# EAGLE design full_design (EAGLE 9.7.0)
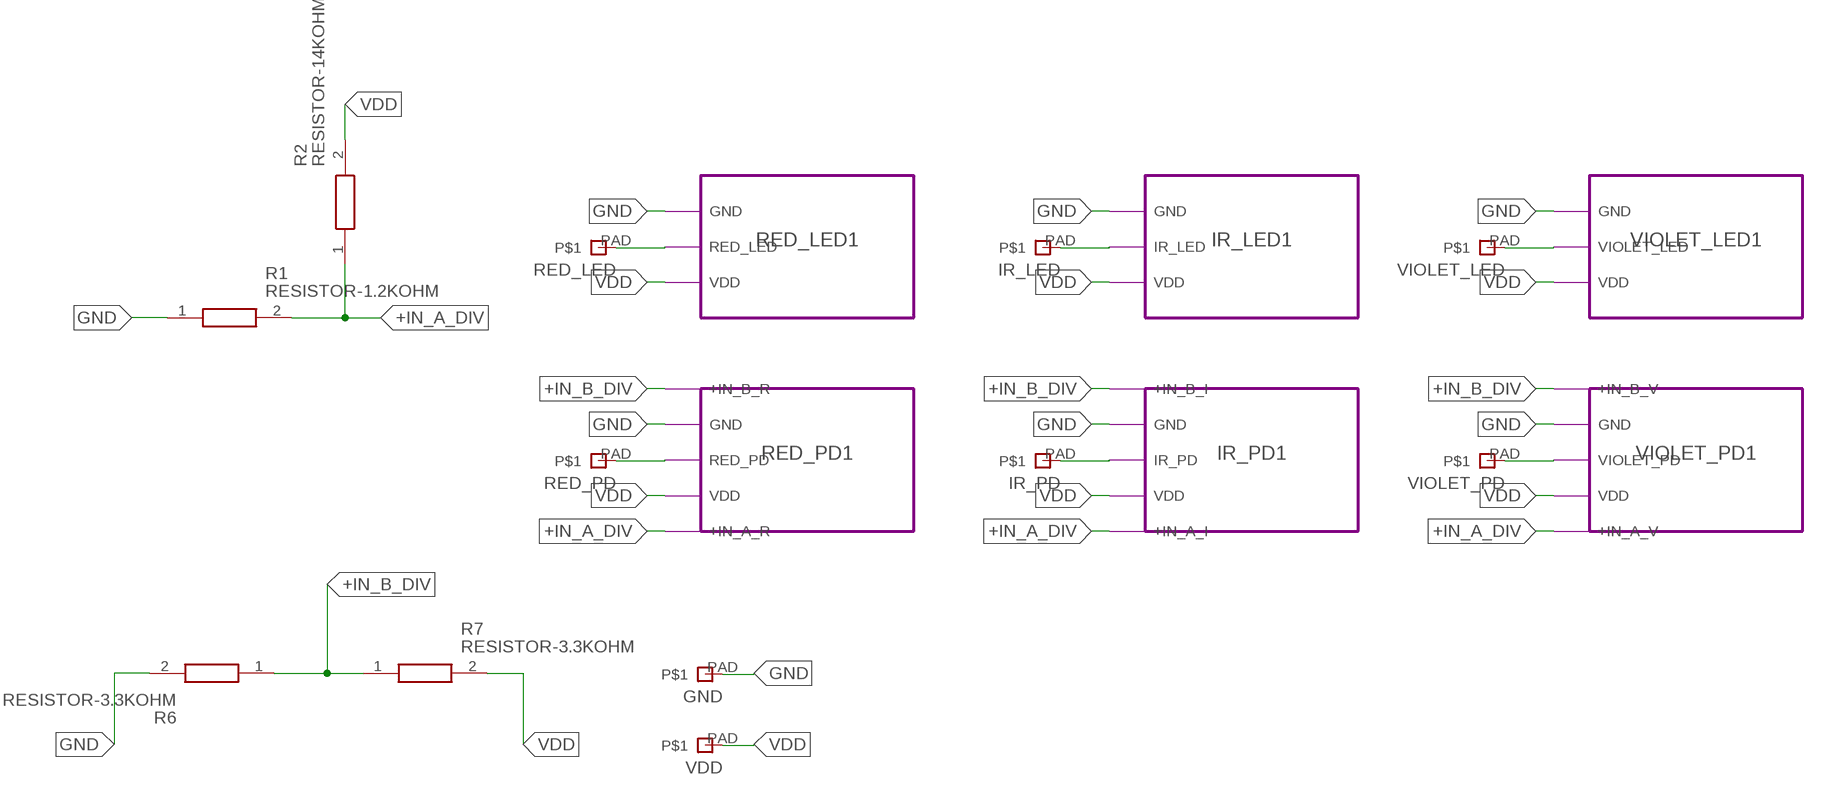
[diagram p0: schematic, sheet 1]

## Parts
GND  PAD  [PAD]
IR_LED  PAD  [PAD]
IR_PD  PAD  [PAD]
R1  RESISTOR-1.2KOHM  [ERJPA2_(0402)]
R2  RESISTOR-14KOHM  [ERJ2RKD1004X]
R6  RESISTOR-3.3KOHM  [ERJPA2_(0402)]
R7  RESISTOR-3.3KOHM  [ERJPA2_(0402)]
RED_LED  PAD  [PAD]
RED_PD  PAD  [PAD]
VDD  PAD  [PAD]
VIOLET_LED  PAD  [PAD]
VIOLET_PD  PAD  [PAD]

## Module instances
RED_LED1 = RED_LED
IR_LED1 = IR_LED
VIOLET_LED1 = VIOLET_LED
RED_PD1 = RED_PD
IR_PD1 = IR_PD
VIOLET_PD1 = VIOLET_PD

## Nets
+IN_A_DIV: R1.2 R2.1 ; port RED_PD1.+IN_A_R IR_PD1.+IN_A_I VIOLET_PD1.+IN_A_V
+IN_B_DIV: R6.1 R7.1 ; port RED_PD1.+IN_B_R IR_PD1.+IN_B_I VIOLET_PD1.+IN_B_V
GND: GND.PAD R1.1 R6.2 ; port RED_LED1.GND RED_PD1.GND IR_LED1.GND VIOLET_LED1.GND IR_PD1.GND VIOLET_PD1.GND
N$1: RED_PD.PAD ; port RED_PD1.RED_PD
N$2: RED_LED.PAD ; port RED_LED1.RED_LED
N$3: IR_LED.PAD ; port IR_LED1.IR_LED
N$4: VIOLET_LED.PAD ; port VIOLET_LED1.VIOLET_LED
N$5: VIOLET_PD.PAD ; port VIOLET_PD1.VIOLET_PD
N$6: IR_PD.PAD ; port IR_PD1.IR_PD
VDD: R2.2 R7.2 VDD.PAD ; port RED_LED1.VDD IR_LED1.VDD VIOLET_LED1.VDD RED_PD1.VDD IR_PD1.VDD VIOLET_PD1.VDD

## Library data of the parts
GND IR_LED IR_PD RED_LED RED_PD VDD VIOLET_LED VIOLET_PD = Nordic_BLE:PAD
R1 = MABOS_Library:RESISTOR-1.2KOHM: Anti-Surge Thick Film Chip Resistor, 0402, 0.2W Source: Datasheet <https://componentsearchengine.com/Datasheets/1/ERJ-PA2D1201X.pdf>; DESCRIPTION: Anti-Surge Thick Film Chip Resistor, 0402, 0.2W; HEIGHT: 0.4mm; MANUFACTURER_NAME: Panasonic; MANUFACTURER_PART_NUMBER: ERJ-PA2D1201X; MOUSER_PART_NUMBER: 667-ERJ-PA2D1201X; MOUSER_PRICE-STOCK: https://www.mouser.com/Search/Refine.aspx?Keyword=667-ERJ-PA2D1201X
R2 = MABOS_Library:RESISTOR-14KOHM: Panasonic ERJ2RK Series Thick Film Resistor 14k +/-1% 0.1W +/-100ppm/C Source: Datasheet <https://componentsearchengine.com/Datasheets/1/ERJ-2RKF1402X.pdf>; DESCRIPTION: Panasonic ERJ2RK Series Thick Film Resistor 14k +/-1% 0.1W +/-100ppm/C; HEIGHT: 0.4mm; MANUFACTURER_NAME: Panasonic; MANUFACTURER_PART_NUMBER: ERJ-2RKF1402X; MOUSER_PART_NUMBER: 667-ERJ-2RKF1402X; MOUSER_PRICE-STOCK: https://www.mouser.com/Search/ProductDetail.aspx?qs=MVjVSMjNRMrMgFTFLdW36A%3d%3d
R6 R7 = MABOS_Library:RESISTOR-3.3KOHM: Anti-Surge Thick Film Chip Resistor, 0402, 0.2W Source: Datasheet <https://componentsearchengine.com/Datasheets/1/ERJ-PA2F3301X.pdf>; DESCRIPTION: Anti-Surge Thick Film Chip Resistor, 0402, 0.2W; HEIGHT: 0.4mm; MANUFACTURER_NAME: Panasonic; MANUFACTURER_PART_NUMBER: ERJ-PA2F3301X; MOUSER_PART_NUMBER: 667-ERJ-PA2F3301X; MOUSER_PRICE-STOCK: https://www.mouser.com/Search/Refine.aspx?Keyword=667-ERJ-PA2F3301X

## Module RED_LED
Ports: GND(pwr) VDD(pwr) RED_LED(in)
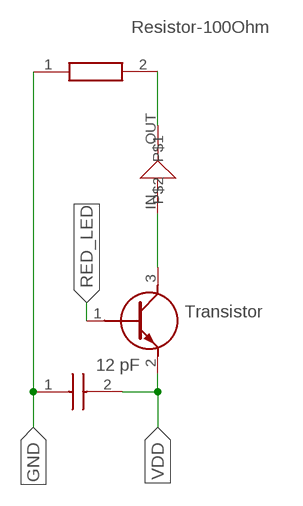
[diagram p1: schematic, module RED_LED, sheet 1]

### Parts
C3  CAPACITOR-12PF  [CAPC1005X55N]
Q1  TRANSISTOR  [SOT883B]
R5  RESISTOR-100OHM  [RESC1608X55N]
U$1  REDLED  [REDLED]

### Nets
GND: C3.1 R5.1
N$7: Q1.3(C) U$1.IN
N$13: R5.2 U$1.OUT
RED_LED: Q1.1(B)
VDD: C3.2 Q1.2(E)

### Library data of the parts
C3 = MABOS_Library:CAPACITOR-12PF: 12 pF; DESCRIPTION: Multilayer Ceramic Capacitors MLCC - SMD/SMT 12pF 2% 25V C0G; HEIGHT: 0.55mm; MANUFACTURER_NAME: Kemet; MANUFACTURER_PART_NUMBER: C0402C120G3GACTU; MOUSER_PART_NUMBER: 80-C0402C120G3G; MOUSER_PRICE-STOCK: https://www.mouser.com/Search/Refine.aspx?Keyword=80-C0402C120G3G
Q1 = MABOS_Library:TRANSISTOR: Bipolar Transistors - BJT 45V NPN 100mA 250mW Source: Datasheet <https://componentsearchengine.com/Datasheets/1/BC847BMB,315.pdf>; DESCRIPTION: Bipolar Transistors - BJT 45V NPN 100mA 250mW; HEIGHT: mm; MANUFACTURER_NAME: Nexperia; MANUFACTURER_PART_NUMBER: BC847BMB,315; MOUSER_PART_NUMBER: 771-BC847BMB315; MOUSER_PRICE-STOCK: https://www.mouser.co.uk/ProductDetail/Nexperia/BC847BMB315?qs=5C9Q4QJFsuN7bUmIcU4LYw%3D%3D
R5 = MABOS_Library:RESISTOR-100OHM: Thick Film Resistors - SMD 100 OHM .1% 50PPM Source: Datasheet; DESCRIPTION: Thick Film Resistors - SMD 100 OHM .1% 50PPM; HEIGHT: 0.55mm; MANUFACTURER_NAME: KOA Speer; MANUFACTURER_PART_NUMBER: RS73G1JTTD1000B; MOUSER_PART_NUMBER: 660-RS73G1JTTD1000B; MOUSER_PRICE-STOCK: https://www.mouser.co.uk/ProductDetail/KOA-Speer/RS73G1JTTD1000B/?qs=GBLSl2AkiruQBcK7exZ%252Bcg%3D%3D
U$1 = MABOS_Library:REDLED

## Module IR_LED
Ports: IR_LED(in) GND(pwr) VDD(pwr)
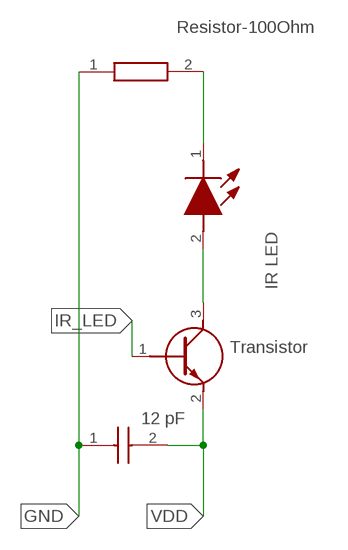
[diagram p2: schematic, module IR_LED, sheet 1]

### Parts
C1  CAPACITOR-12PF  [CAPC1005X55N]
LED1  IRLED  [LEDC3216X180N]
Q1  TRANSISTOR  [SOT883B]
R1  RESISTOR-100OHM  [RESC1608X55N]

### Nets
GND: C1.1 R1.1
IR_LED: Q1.1(B)
N$1: LED1.1(K) R1.2
N$4: LED1.2(A) Q1.3(C)
VDD: C1.2 Q1.2(E)

### Library data of the parts
C1 = MABOS_Library:CAPACITOR-12PF: 12 pF; DESCRIPTION: Multilayer Ceramic Capacitors MLCC - SMD/SMT 12pF 2% 25V C0G; HEIGHT: 0.55mm; MANUFACTURER_NAME: Kemet; MANUFACTURER_PART_NUMBER: C0402C120G3GACTU; MOUSER_PART_NUMBER: 80-C0402C120G3G; MOUSER_PRICE-STOCK: https://www.mouser.com/Search/Refine.aspx?Keyword=80-C0402C120G3G
LED1 = MABOS_Library:IRLED: Infrared Emitters 3.2x1.6mm IR SMD LED Source: Datasheet <https://www.arrow.com/en/products/aptd3216f3c-p22/kingbright>; DESCRIPTION: Infrared Emitters 3.2x1.6mm IR SMD LED; HEIGHT: 1.8mm; MANUFACTURER_NAME: Kingbright; MANUFACTURER_PART_NUMBER: APTD3216F3C-P22; MOUSER_PART_NUMBER: 604-APTD3216F3C-P22; MOUSER_PRICE-STOCK: https://www.mouser.co.uk/ProductDetail/Kingbright/APTD3216F3C-P22?qs=fAHHVMwC%252Bbjo55EMkwMBzg%3D%3D
Q1 = MABOS_Library:TRANSISTOR: Bipolar Transistors - BJT 45V NPN 100mA 250mW Source: Datasheet <https://componentsearchengine.com/Datasheets/1/BC847BMB,315.pdf>; DESCRIPTION: Bipolar Transistors - BJT 45V NPN 100mA 250mW; HEIGHT: mm; MANUFACTURER_NAME: Nexperia; MANUFACTURER_PART_NUMBER: BC847BMB,315; MOUSER_PART_NUMBER: 771-BC847BMB315; MOUSER_PRICE-STOCK: https://www.mouser.co.uk/ProductDetail/Nexperia/BC847BMB315?qs=5C9Q4QJFsuN7bUmIcU4LYw%3D%3D
R1 = MABOS_Library:RESISTOR-100OHM: Thick Film Resistors - SMD 100 OHM .1% 50PPM Source: Datasheet; DESCRIPTION: Thick Film Resistors - SMD 100 OHM .1% 50PPM; HEIGHT: 0.55mm; MANUFACTURER_NAME: KOA Speer; MANUFACTURER_PART_NUMBER: RS73G1JTTD1000B; MOUSER_PART_NUMBER: 660-RS73G1JTTD1000B; MOUSER_PRICE-STOCK: https://www.mouser.co.uk/ProductDetail/KOA-Speer/RS73G1JTTD1000B/?qs=GBLSl2AkiruQBcK7exZ%252Bcg%3D%3D

## Module VIOLET_LED
Ports: GND(pwr) VDD(pwr) VIOLET_LED(in)
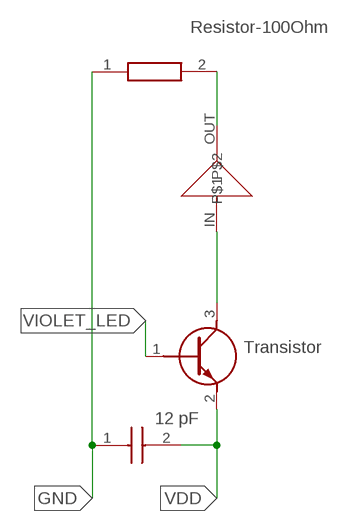
[diagram p3: schematic, module VIOLET_LED, sheet 1]

### Parts
C1  CAPACITOR-12PF  [CAPC1005X55N]
Q1  TRANSISTOR  [SOT883B]
R1  RESISTOR-100OHM  [RESC1608X55N]
U$1  UVLED  [UVLED]

### Nets
GND: C1.1 R1.1
N$1: R1.2 U$1.OUT
N$2: Q1.3(C) U$1.IN
VDD: C1.2 Q1.2(E)
VIOLET_LED: Q1.1(B)

### Library data of the parts
C1 = MABOS_Library:CAPACITOR-12PF: 12 pF; DESCRIPTION: Multilayer Ceramic Capacitors MLCC - SMD/SMT 12pF 2% 25V C0G; HEIGHT: 0.55mm; MANUFACTURER_NAME: Kemet; MANUFACTURER_PART_NUMBER: C0402C120G3GACTU; MOUSER_PART_NUMBER: 80-C0402C120G3G; MOUSER_PRICE-STOCK: https://www.mouser.com/Search/Refine.aspx?Keyword=80-C0402C120G3G
Q1 = MABOS_Library:TRANSISTOR: Bipolar Transistors - BJT 45V NPN 100mA 250mW Source: Datasheet <https://componentsearchengine.com/Datasheets/1/BC847BMB,315.pdf>; DESCRIPTION: Bipolar Transistors - BJT 45V NPN 100mA 250mW; HEIGHT: mm; MANUFACTURER_NAME: Nexperia; MANUFACTURER_PART_NUMBER: BC847BMB,315; MOUSER_PART_NUMBER: 771-BC847BMB315; MOUSER_PRICE-STOCK: https://www.mouser.co.uk/ProductDetail/Nexperia/BC847BMB315?qs=5C9Q4QJFsuN7bUmIcU4LYw%3D%3D
R1 = MABOS_Library:RESISTOR-100OHM: Thick Film Resistors - SMD 100 OHM .1% 50PPM Source: Datasheet; DESCRIPTION: Thick Film Resistors - SMD 100 OHM .1% 50PPM; HEIGHT: 0.55mm; MANUFACTURER_NAME: KOA Speer; MANUFACTURER_PART_NUMBER: RS73G1JTTD1000B; MOUSER_PART_NUMBER: 660-RS73G1JTTD1000B; MOUSER_PRICE-STOCK: https://www.mouser.co.uk/ProductDetail/KOA-Speer/RS73G1JTTD1000B/?qs=GBLSl2AkiruQBcK7exZ%252Bcg%3D%3D
U$1 = MABOS_Library:UVLED

## Module RED_PD
Ports: GND(pwr) VDD(pwr) RED_PD(pwr) +IN_A_R(pwr) +IN_B_R(pwr)
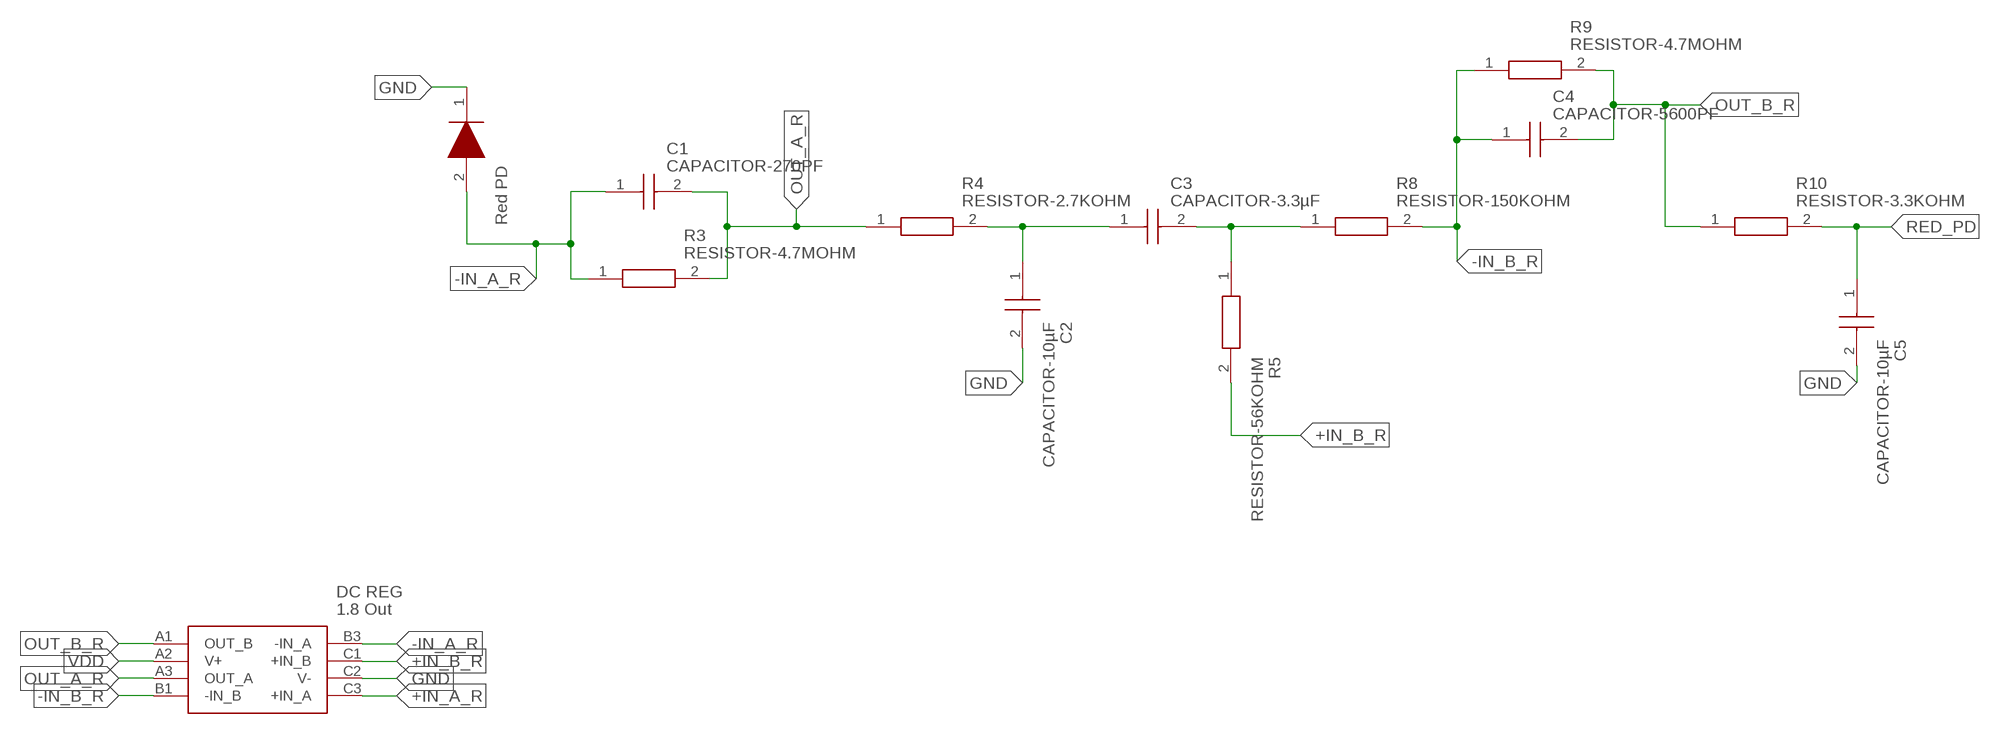
[diagram p4: schematic, module RED_PD, sheet 1]

### Parts
C1  CAPACITOR-270PF  [CAPC1005X55N]
C2  CAPACITOR-10µF  [C0402]
C3  CAPACITOR-3.3µF  [C0402]
C4  CAPACITOR-5600PF  [CAPC1005X55N]
C5  CAPACITOR-10µF  [C0402]
D1  REDPD  [SFH2713]
IC1  ADA4505-2  [BGA8C50P3X3_142X142X65]
R3  RESISTOR-4.7MOHM  [ERJ2RKD1004X]
R4  RESISTOR-2.7KOHM  [ERJPA2_(0402)]
R5  RESISTOR-56KOHM  [ERJ2RKD1004X]
R8  RESISTOR-150KOHM  [ERJS02_U02_(0402)]
R9  RESISTOR-4.7MOHM  [ERJ2RKD1004X]
R10  RESISTOR-3.3KOHM  [ERJPA2_(0402)]

### Nets
+IN_A_R: IC1.C3(+IN_A)
+IN_B_R: IC1.C1(+IN_B) R5.2
-IN_A_R: C1.1 D1.2(A) IC1.B3(-IN_A) R3.1
-IN_B_R: C4.1 IC1.B1(-IN_B) R8.2 R9.1
GND: C2.2 C5.2 D1.1(K) IC1.C2(V-)
N$1: C2.1 C3.1 R4.2
N$3: C3.2 R5.1 R8.1
OUT_A_R: C1.2 IC1.A3(OUT_A) R3.2 R4.1
OUT_B_R: C4.2 IC1.A1(OUT_B) R9.2 R10.1
RED_PD: C5.1 R10.2
VDD: IC1.A2(V+)

### Library data of the parts
C1 = MABOS_Library:CAPACITOR-270PF: SMD Comm C0G, Ceramic, 270 pF, 2%, 50 VDC, 125 VDC, 125C, -55C, C0G, SMD, MLCC, Ultra-Stable, Low Loss, Class I, 0.1 % , 100 GOhms, 1.06 mg, 0402, 1mm, 0.5mm, 0.5mm, 0.3mm, 0.3mm, 10000, 78 Weeks, 120 Source: Datasheet <https://componentsearchengine.com/Datasheets/1/C0402C271G5GACTU.pdf>; DESCRIPTION: SMD Comm C0G, Ceramic, 270 pF, 2%, 50 VDC, 125 VDC, 125C, -55C, C0G, SMD, MLCC, Ultra-Stable, Low Loss, Class I, 0.1 % , 100 GOhms, 1.06 mg, 0402, 1mm, 0.5mm, 0.5mm, 0.3mm, 0.3mm, 10000, 78 Weeks, 120; HEIGHT: 0.55mm; MANUFACTURER_NAME: KEMET; MANUFACTURER_PART_NUMBER: C0402C271G5GACTU; MOUSER_PART_NUMBER: 80-C0402C271G5G; MOUSER_PRICE-STOCK: https://www.mouser.com/Search/Refine.aspx?Keyword=80-C0402C271G5G
C2 C5 = MABOS_Library:CAPACITOR-10µF: SMD Comm X5R, Ceramic, 10 uF, 20%, 6.3 VDC, 15.75 VDC, 85C, -55C, X5R, SMD, MLCC, Temperature Stable, Class II, 10 % , 10 MOhms, 1.41 mg, 0402, 1mm, 0.5mm, 0.5mm, 0.3mm, 0.3mm, 10000, 78 Weeks, 70 Source: Datasheet <https://content.kemet.com/datasheets/KEM_C1006_X5R_SMD.pdf>; DESCRIPTION: SMD Comm X5R, Ceramic, 10 uF, 20%, 6.3 VDC, 15.75 VDC, 85C, -55C, X5R, SMD, MLCC, Temperature Stable, Class II, 10 % , 10 MOhms, 1.41 mg, 0402, 1mm, 0.5mm, 0.5mm, 0.3mm, 0.3mm, 10000, 78 Weeks, 70; HEIGHT: 0.55mm; MANUFACTURER_NAME: KEMET; MANUFACTURER_PART_NUMBER: C0402C106M9PACTU; MOUSER_PART_NUMBER: 80-C0402C106M9P; MOUSER_PRICE-STOCK: https://www.mouser.co.uk/ProductDetail/KEMET/C0402C106M9PACTU?qs=x4XeXhDQKnp%252Bz0lMlwMC3A%3D%3D
C3 = MABOS_Library:CAPACITOR-3.3µF: SMD Comm X5R, Ceramic, 3.3 uF, 20%, 4 VDC, 10 VDC, 85C, -55C, X5R, SMD, MLCC, Temperature Stable, Class II, 10 % , 30.3 MOhms, 1.21 mg, 0402, 1mm, 0.5mm, 0.5mm, 0.3mm, 0.3mm, 10000, 78 Weeks, 70 Source: Datasheet <https://content.kemet.com/datasheets/KEM_C1006_X5R_SMD.pdf>; DESCRIPTION: SMD Comm X5R, Ceramic, 3.3 uF, 20%, 4 VDC, 10 VDC, 85C, -55C, X5R, SMD, MLCC, Temperature Stable, Class II, 10 % , 30.3 MOhms, 1.21 mg, 0402, 1mm, 0.5mm, 0.5mm, 0.3mm, 0.3mm, 10000, 78 Weeks, 70; HEIGHT: 0.55mm; MANUFACTURER_NAME: KEMET; MANUFACTURER_PART_NUMBER: C0402C335M7PACTU; MOUSER_PART_NUMBER: 80-C0402C335M7P; MOUSER_PRICE-STOCK: https://www.mouser.co.uk/ProductDetail/KEMET/C0402C335M7PACTU?qs=K%2Fj%2Fqf%252B0fqJuKSSbbJXSEQ%3D%3D
C4 = MABOS_Library:CAPACITOR-5600PF: SMD Comm X7R, Ceramic, 5600 pF, 5%, 16 VDC, 40 VDC, 125C, -55C, X7R, SMD, MLCC, Temperature Stable, Class II, 3.5 % , 100 GOhms, 1.21 mg, 0402, 1mm, 0.5mm, 0.5mm, 0.3mm, 0.3mm, 10000, 78 Weeks, 80 Source: Datasheet <https://content.kemet.com/datasheets/KEM_C1002_X7R_SMD.pdf>; DESCRIPTION: SMD Comm X7R, Ceramic, 5600 pF, 5%, 16 VDC, 40 VDC, 125C, -55C, X7R, SMD, MLCC, Temperature Stable, Class II, 3.5 % , 100 GOhms, 1.21 mg, 0402, 1mm, 0.5mm, 0.5mm, 0.3mm, 0.3mm, 10000, 78 Weeks, 80; HEIGHT: 0.55mm; MANUFACTURER_NAME: KEMET; MANUFACTURER_PART_NUMBER: C0402C562J4RACTU; MOUSER_PART_NUMBER: 80-C0402C562J4R; MOUSER_PRICE-STOCK: https://www.mouser.co.uk/ProductDetail/KEMET/C0402C562J4RACTU?qs=YJD0VjdmSUns5e35Blws8w%3D%3D
D1 = MABOS_Library:REDPD: Photodiodes Silicon PIN Photodiode Source: Datasheet <https://dammedia.osram.info/media/resource/hires/osram-dam-8960377/SFH 2713_EN.pdf>; DESCRIPTION: Photodiodes Silicon PIN Photodiode; HEIGHT: 0.7mm; MANUFACTURER_NAME: OSRAM; MANUFACTURER_PART_NUMBER: SFH 2713; MOUSER_PART_NUMBER: 720-SFH2713; MOUSER_PRICE-STOCK: https://www.mouser.co.uk/ProductDetail/OSRAM-Opto-Semiconductors/SFH-2713?qs=7MVldsJ5UayBhtoy5c4X7w%3D%3D
IC1 = MABOS_Library:ADA4505-2: Op Amp (2); DESCRIPTION: ANALOG DEVICES - ADA4505-2ACBZ-R7 - OP-AMP, DUAL, 50KHZ, WLCSP-8; HEIGHT: 0.65mm; MANUFACTURER_NAME: Analog Devices; MANUFACTURER_PART_NUMBER: ADA4505-2ACBZ-R7; MOUSER_PART_NUMBER: 584-ADA4505-2ACBZ-R7; MOUSER_PRICE-STOCK: https://www.mouser.co.uk/ProductDetail/Analog-Devices/ADA4505-2ACBZ-R7?qs=BpaRKvA4VqEsLtXU3NSLDQ%3D%3D
R3 R9 = MABOS_Library:RESISTOR-4.7MOHM: Panasonic ERJ2GEJ Series Thick Film Surface Mount Fixed Resistor 0402 Case 4.7M +/-5% 0.1W -400 +150ppm/C Source: Datasheet <https://componentsearchengine.com/Datasheets/1/ERJ-2GEJ475X.pdf>; DESCRIPTION: Panasonic ERJ2GEJ Series Thick Film Surface Mount Fixed Resistor 0402 Case 4.7M +/-5% 0.1W -400 +150ppm/C; HEIGHT: 0.4mm; MANUFACTURER_NAME: Panasonic; MANUFACTURER_PART_NUMBER: ERJ-2GEJ475X; MOUSER_PART_NUMBER: 667-ERJ-2GEJ475X; MOUSER_PRICE-STOCK: https://www.mouser.com/Search/Refine.aspx?Keyword=667-ERJ-2GEJ475X
R4 = MABOS_Library:RESISTOR-2.7KOHM: Anti-Surge Thick Film Chip Resistor, 0402, 0.2W Source: Datasheet <http://industrial.panasonic.com/cdbs/www-data/pdf/RDO0000/AOA0000C331.pdf>; DESCRIPTION: Anti-Surge Thick Film Chip Resistor, 0402, 0.2W; HEIGHT: 0.4mm; MANUFACTURER_NAME: Panasonic; MANUFACTURER_PART_NUMBER: ERJ-PA2F2701X
R5 = MABOS_Library:RESISTOR-56KOHM: Precision Thick Film Chip Resistor, 0402, 0.063W Source: Datasheet <https://componentsearchengine.com/Datasheets/1/ERJ-2RKF5602X.pdf>; DESCRIPTION: Precision Thick Film Chip Resistor, 0402, 0.063W; HEIGHT: 0.4mm; MANUFACTURER_NAME: Panasonic; MANUFACTURER_PART_NUMBER: ERJ-2RKF5602X; MOUSER_PART_NUMBER: 667-ERJ-2RKF5602X; MOUSER_PRICE-STOCK: https://www.mouser.com/Search/Refine.aspx?Keyword=667-ERJ-2RKF5602X
R8 = MABOS_Library:RESISTOR-150KOHM: Anti-Sulfurated Thick Film Chip Resistor, 0402, 0.1W Source: Datasheet <https://componentsearchengine.com/Datasheets/1/ERJ-U02D1503X.pdf>; DESCRIPTION: Anti-Sulfurated Thick Film Chip Resistor, 0402, 0.1W; HEIGHT: 0.4mm; MANUFACTURER_NAME: Panasonic; MANUFACTURER_PART_NUMBER: ERJ-U02D1503X; MOUSER_PART_NUMBER: 667-ERJ-U02D1503X; MOUSER_PRICE-STOCK: https://www.mouser.com/Search/Refine.aspx?Keyword=667-ERJ-U02D1503X
R10 = MABOS_Library:RESISTOR-3.3KOHM: Anti-Surge Thick Film Chip Resistor, 0402, 0.2W Source: Datasheet <https://componentsearchengine.com/Datasheets/1/ERJ-PA2F3301X.pdf>; DESCRIPTION: Anti-Surge Thick Film Chip Resistor, 0402, 0.2W; HEIGHT: 0.4mm; MANUFACTURER_NAME: Panasonic; MANUFACTURER_PART_NUMBER: ERJ-PA2F3301X; MOUSER_PART_NUMBER: 667-ERJ-PA2F3301X; MOUSER_PRICE-STOCK: https://www.mouser.com/Search/Refine.aspx?Keyword=667-ERJ-PA2F3301X

## Module IR_PD
Ports: +IN_B_I(pwr) +IN_A_I(pwr) GND(pwr) VDD(pwr) IR_PD(out)
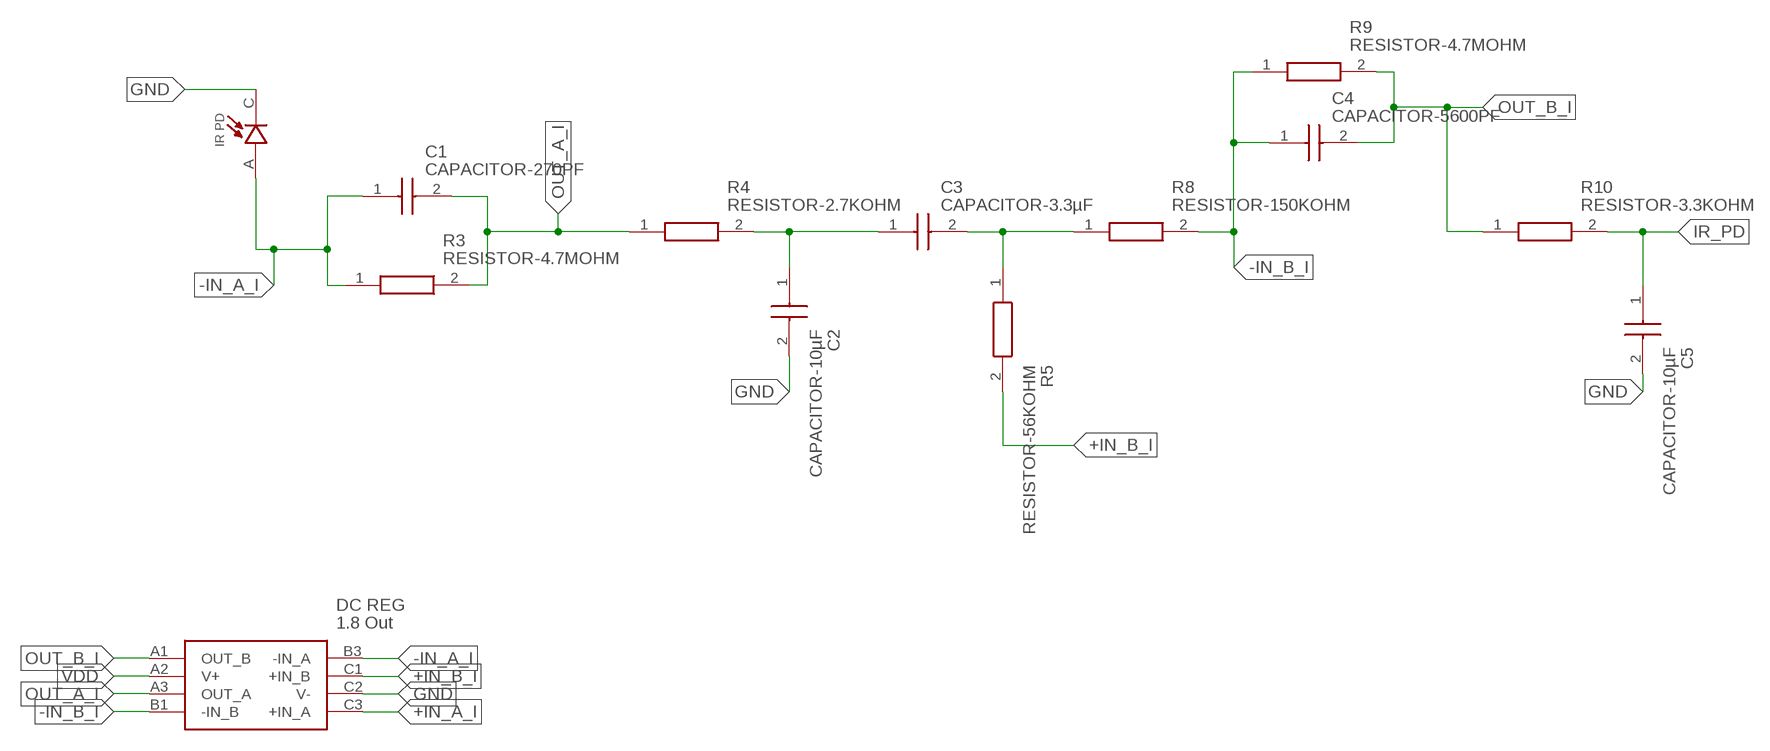
[diagram p5: schematic, module IR_PD, sheet 1]

### Parts
C1  CAPACITOR-270PF  [CAPC1005X55N]
C2  CAPACITOR-10µF  [C0402]
C3  CAPACITOR-3.3µF  [C0402]
C4  CAPACITOR-5600PF  [CAPC1005X55N]
C5  CAPACITOR-10µF  [C0402]
D1  IRPD  [XDCR_VEMD2023X01]
IC1  ADA4505-2  [BGA8C50P3X3_142X142X65]
R3  RESISTOR-4.7MOHM  [ERJ2RKD1004X]
R4  RESISTOR-2.7KOHM  [ERJPA2_(0402)]
R5  RESISTOR-56KOHM  [ERJ2RKD1004X]
R8  RESISTOR-150KOHM  [ERJS02_U02_(0402)]
R9  RESISTOR-4.7MOHM  [ERJ2RKD1004X]
R10  RESISTOR-3.3KOHM  [ERJPA2_(0402)]

### Nets
+IN_A_I: IC1.C3(+IN_A)
+IN_B_I: IC1.C1(+IN_B) R5.2
-IN_A_I: C1.1 D1.A IC1.B3(-IN_A) R3.1
-IN_B_I: C4.1 IC1.B1(-IN_B) R8.2 R9.1
GND: C2.2 C5.2 D1.C IC1.C2(V-)
IR_PD: C5.1 R10.2
N$5: C2.1 C3.1 R4.2
N$7: C3.2 R5.1 R8.1
OUT_A_I: C1.2 IC1.A3(OUT_A) R3.2 R4.1
OUT_B_I: C4.2 IC1.A1(OUT_B) R9.2 R10.1
VDD: IC1.A2(V+)

### Library data of the parts
C1 = MABOS_Library:CAPACITOR-270PF: SMD Comm C0G, Ceramic, 270 pF, 2%, 50 VDC, 125 VDC, 125C, -55C, C0G, SMD, MLCC, Ultra-Stable, Low Loss, Class I, 0.1 % , 100 GOhms, 1.06 mg, 0402, 1mm, 0.5mm, 0.5mm, 0.3mm, 0.3mm, 10000, 78 Weeks, 120 Source: Datasheet <https://componentsearchengine.com/Datasheets/1/C0402C271G5GACTU.pdf>; DESCRIPTION: SMD Comm C0G, Ceramic, 270 pF, 2%, 50 VDC, 125 VDC, 125C, -55C, C0G, SMD, MLCC, Ultra-Stable, Low Loss, Class I, 0.1 % , 100 GOhms, 1.06 mg, 0402, 1mm, 0.5mm, 0.5mm, 0.3mm, 0.3mm, 10000, 78 Weeks, 120; HEIGHT: 0.55mm; MANUFACTURER_NAME: KEMET; MANUFACTURER_PART_NUMBER: C0402C271G5GACTU; MOUSER_PART_NUMBER: 80-C0402C271G5G; MOUSER_PRICE-STOCK: https://www.mouser.com/Search/Refine.aspx?Keyword=80-C0402C271G5G
C2 C5 = MABOS_Library:CAPACITOR-10µF: SMD Comm X5R, Ceramic, 10 uF, 20%, 6.3 VDC, 15.75 VDC, 85C, -55C, X5R, SMD, MLCC, Temperature Stable, Class II, 10 % , 10 MOhms, 1.41 mg, 0402, 1mm, 0.5mm, 0.5mm, 0.3mm, 0.3mm, 10000, 78 Weeks, 70 Source: Datasheet <https://content.kemet.com/datasheets/KEM_C1006_X5R_SMD.pdf>; DESCRIPTION: SMD Comm X5R, Ceramic, 10 uF, 20%, 6.3 VDC, 15.75 VDC, 85C, -55C, X5R, SMD, MLCC, Temperature Stable, Class II, 10 % , 10 MOhms, 1.41 mg, 0402, 1mm, 0.5mm, 0.5mm, 0.3mm, 0.3mm, 10000, 78 Weeks, 70; HEIGHT: 0.55mm; MANUFACTURER_NAME: KEMET; MANUFACTURER_PART_NUMBER: C0402C106M9PACTU; MOUSER_PART_NUMBER: 80-C0402C106M9P; MOUSER_PRICE-STOCK: https://www.mouser.co.uk/ProductDetail/KEMET/C0402C106M9PACTU?qs=x4XeXhDQKnp%252Bz0lMlwMC3A%3D%3D
C3 = MABOS_Library:CAPACITOR-3.3µF: SMD Comm X5R, Ceramic, 3.3 uF, 20%, 4 VDC, 10 VDC, 85C, -55C, X5R, SMD, MLCC, Temperature Stable, Class II, 10 % , 30.3 MOhms, 1.21 mg, 0402, 1mm, 0.5mm, 0.5mm, 0.3mm, 0.3mm, 10000, 78 Weeks, 70 Source: Datasheet <https://content.kemet.com/datasheets/KEM_C1006_X5R_SMD.pdf>; DESCRIPTION: SMD Comm X5R, Ceramic, 3.3 uF, 20%, 4 VDC, 10 VDC, 85C, -55C, X5R, SMD, MLCC, Temperature Stable, Class II, 10 % , 30.3 MOhms, 1.21 mg, 0402, 1mm, 0.5mm, 0.5mm, 0.3mm, 0.3mm, 10000, 78 Weeks, 70; HEIGHT: 0.55mm; MANUFACTURER_NAME: KEMET; MANUFACTURER_PART_NUMBER: C0402C335M7PACTU; MOUSER_PART_NUMBER: 80-C0402C335M7P; MOUSER_PRICE-STOCK: https://www.mouser.co.uk/ProductDetail/KEMET/C0402C335M7PACTU?qs=K%2Fj%2Fqf%252B0fqJuKSSbbJXSEQ%3D%3D
C4 = MABOS_Library:CAPACITOR-5600PF: SMD Comm X7R, Ceramic, 5600 pF, 5%, 16 VDC, 40 VDC, 125C, -55C, X7R, SMD, MLCC, Temperature Stable, Class II, 3.5 % , 100 GOhms, 1.21 mg, 0402, 1mm, 0.5mm, 0.5mm, 0.3mm, 0.3mm, 10000, 78 Weeks, 80 Source: Datasheet <https://content.kemet.com/datasheets/KEM_C1002_X7R_SMD.pdf>; DESCRIPTION: SMD Comm X7R, Ceramic, 5600 pF, 5%, 16 VDC, 40 VDC, 125C, -55C, X7R, SMD, MLCC, Temperature Stable, Class II, 3.5 % , 100 GOhms, 1.21 mg, 0402, 1mm, 0.5mm, 0.5mm, 0.3mm, 0.3mm, 10000, 78 Weeks, 80; HEIGHT: 0.55mm; MANUFACTURER_NAME: KEMET; MANUFACTURER_PART_NUMBER: C0402C562J4RACTU; MOUSER_PART_NUMBER: 80-C0402C562J4R; MOUSER_PRICE-STOCK: https://www.mouser.co.uk/ProductDetail/KEMET/C0402C562J4RACTU?qs=YJD0VjdmSUns5e35Blws8w%3D%3D
D1 = MABOS_Library:IRPD: Check availability <https://pricing.snapeda.com/parts/VEMD2023X01/Vishay%20Semiconductor/view-part?ref=eda>; AVAILABILITY: In Stock; DESCRIPTION: Photodiode 940nm 100ns 70° 2-SMD; MF: Vishay Semiconductor; MP: VEMD2023X01; PACKAGE: SMD-2 Vishay Semiconductor; PRICE: None; PURCHASE-URL: https://pricing.snapeda.com/search/part/VEMD2023X01/?ref=eda
IC1 = MABOS_Library:ADA4505-2: Op Amp (2); DESCRIPTION: ANALOG DEVICES - ADA4505-2ACBZ-R7 - OP-AMP, DUAL, 50KHZ, WLCSP-8; HEIGHT: 0.65mm; MANUFACTURER_NAME: Analog Devices; MANUFACTURER_PART_NUMBER: ADA4505-2ACBZ-R7; MOUSER_PART_NUMBER: 584-ADA4505-2ACBZ-R7; MOUSER_PRICE-STOCK: https://www.mouser.co.uk/ProductDetail/Analog-Devices/ADA4505-2ACBZ-R7?qs=BpaRKvA4VqEsLtXU3NSLDQ%3D%3D
R3 R9 = MABOS_Library:RESISTOR-4.7MOHM: Panasonic ERJ2GEJ Series Thick Film Surface Mount Fixed Resistor 0402 Case 4.7M +/-5% 0.1W -400 +150ppm/C Source: Datasheet <https://componentsearchengine.com/Datasheets/1/ERJ-2GEJ475X.pdf>; DESCRIPTION: Panasonic ERJ2GEJ Series Thick Film Surface Mount Fixed Resistor 0402 Case 4.7M +/-5% 0.1W -400 +150ppm/C; HEIGHT: 0.4mm; MANUFACTURER_NAME: Panasonic; MANUFACTURER_PART_NUMBER: ERJ-2GEJ475X; MOUSER_PART_NUMBER: 667-ERJ-2GEJ475X; MOUSER_PRICE-STOCK: https://www.mouser.com/Search/Refine.aspx?Keyword=667-ERJ-2GEJ475X
R4 = MABOS_Library:RESISTOR-2.7KOHM: Anti-Surge Thick Film Chip Resistor, 0402, 0.2W Source: Datasheet <http://industrial.panasonic.com/cdbs/www-data/pdf/RDO0000/AOA0000C331.pdf>; DESCRIPTION: Anti-Surge Thick Film Chip Resistor, 0402, 0.2W; HEIGHT: 0.4mm; MANUFACTURER_NAME: Panasonic; MANUFACTURER_PART_NUMBER: ERJ-PA2F2701X
R5 = MABOS_Library:RESISTOR-56KOHM: Precision Thick Film Chip Resistor, 0402, 0.063W Source: Datasheet <https://componentsearchengine.com/Datasheets/1/ERJ-2RKF5602X.pdf>; DESCRIPTION: Precision Thick Film Chip Resistor, 0402, 0.063W; HEIGHT: 0.4mm; MANUFACTURER_NAME: Panasonic; MANUFACTURER_PART_NUMBER: ERJ-2RKF5602X; MOUSER_PART_NUMBER: 667-ERJ-2RKF5602X; MOUSER_PRICE-STOCK: https://www.mouser.com/Search/Refine.aspx?Keyword=667-ERJ-2RKF5602X
R8 = MABOS_Library:RESISTOR-150KOHM: Anti-Sulfurated Thick Film Chip Resistor, 0402, 0.1W Source: Datasheet <https://componentsearchengine.com/Datasheets/1/ERJ-U02D1503X.pdf>; DESCRIPTION: Anti-Sulfurated Thick Film Chip Resistor, 0402, 0.1W; HEIGHT: 0.4mm; MANUFACTURER_NAME: Panasonic; MANUFACTURER_PART_NUMBER: ERJ-U02D1503X; MOUSER_PART_NUMBER: 667-ERJ-U02D1503X; MOUSER_PRICE-STOCK: https://www.mouser.com/Search/Refine.aspx?Keyword=667-ERJ-U02D1503X
R10 = MABOS_Library:RESISTOR-3.3KOHM: Anti-Surge Thick Film Chip Resistor, 0402, 0.2W Source: Datasheet <https://componentsearchengine.com/Datasheets/1/ERJ-PA2F3301X.pdf>; DESCRIPTION: Anti-Surge Thick Film Chip Resistor, 0402, 0.2W; HEIGHT: 0.4mm; MANUFACTURER_NAME: Panasonic; MANUFACTURER_PART_NUMBER: ERJ-PA2F3301X; MOUSER_PART_NUMBER: 667-ERJ-PA2F3301X; MOUSER_PRICE-STOCK: https://www.mouser.com/Search/Refine.aspx?Keyword=667-ERJ-PA2F3301X

## Module VIOLET_PD
Ports: VIOLET_PD(out) +IN_B_V(pwr) +IN_A_V(pwr) GND(pwr) VDD(pwr)
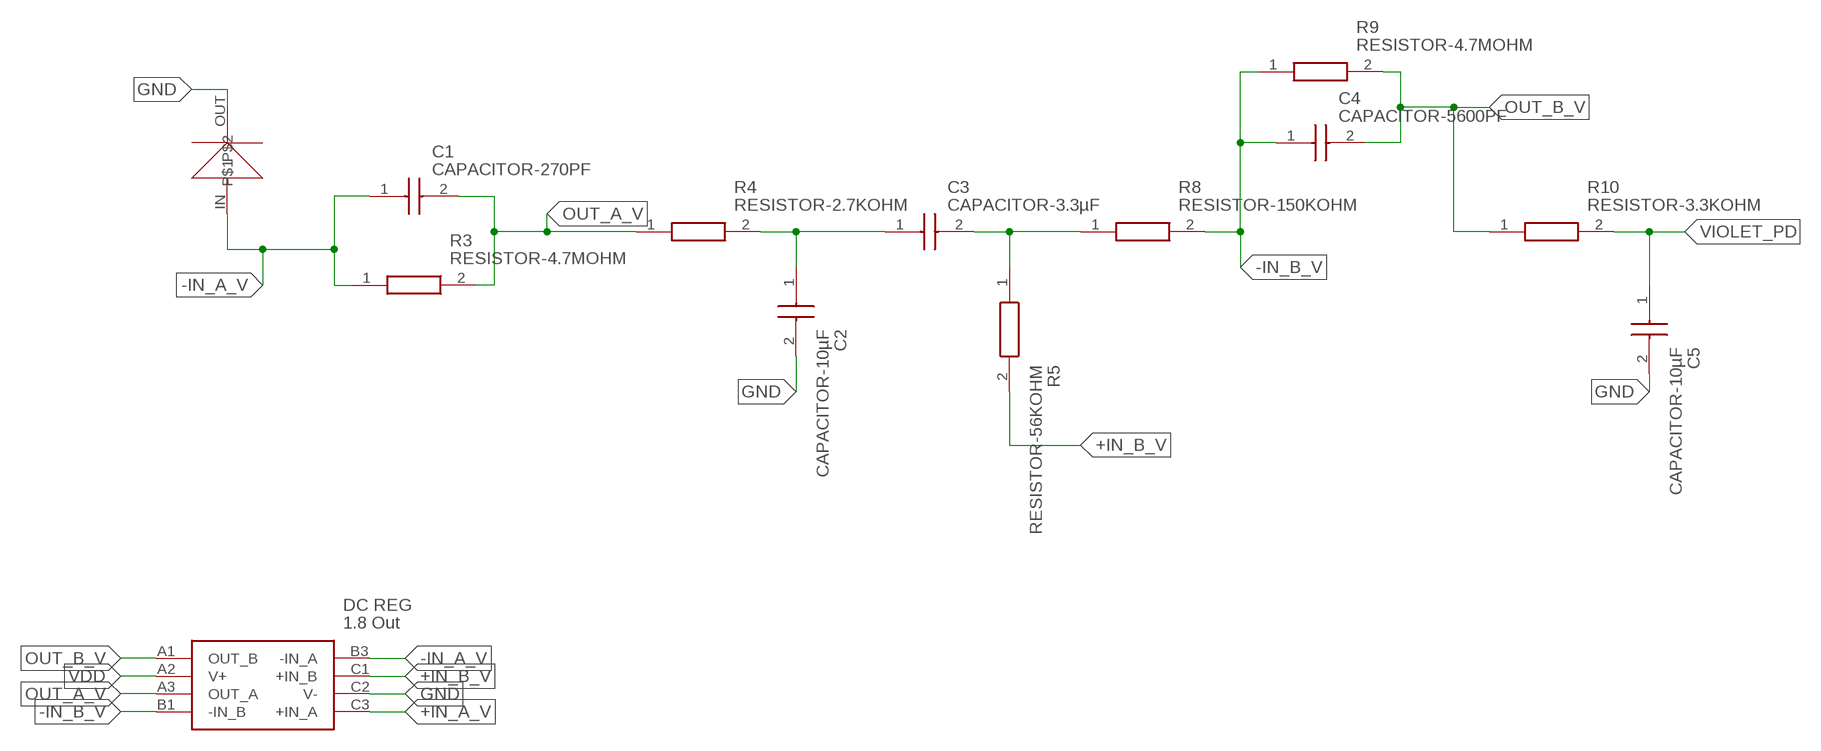
[diagram p6: schematic, module VIOLET_PD, sheet 1]

### Parts
C1  CAPACITOR-270PF  [CAPC1005X55N]
C2  CAPACITOR-10µF  [C0402]
C3  CAPACITOR-3.3µF  [C0402]
C4  CAPACITOR-5600PF  [CAPC1005X55N]
C5  CAPACITOR-10µF  [C0402]
IC1  ADA4505-2  [BGA8C50P3X3_142X142X65]
R3  RESISTOR-4.7MOHM  [ERJ2RKD1004X]
R4  RESISTOR-2.7KOHM  [ERJPA2_(0402)]
R5  RESISTOR-56KOHM  [ERJ2RKD1004X]
R8  RESISTOR-150KOHM  [ERJS02_U02_(0402)]
R9  RESISTOR-4.7MOHM  [ERJ2RKD1004X]
R10  RESISTOR-3.3KOHM  [ERJPA2_(0402)]
U$1  UVPD  [UVPD]

### Nets
+IN_A_V: IC1.C3(+IN_A)
+IN_B_V: IC1.C1(+IN_B) R5.2
-IN_A_V: C1.1 IC1.B3(-IN_A) R3.1 U$1.IN
-IN_B_V: C4.1 IC1.B1(-IN_B) R8.2 R9.1
GND: C2.2 C5.2 IC1.C2(V-) U$1.OUT
N$5: C2.1 C3.1 R4.2
N$7: C3.2 R5.1 R8.1
OUT_A_V: C1.2 IC1.A3(OUT_A) R3.2 R4.1
OUT_B_V: C4.2 IC1.A1(OUT_B) R9.2 R10.1
VDD: IC1.A2(V+)
VIOLET_PD: C5.1 R10.2

### Library data of the parts
C1 = MABOS_Library:CAPACITOR-270PF: SMD Comm C0G, Ceramic, 270 pF, 2%, 50 VDC, 125 VDC, 125C, -55C, C0G, SMD, MLCC, Ultra-Stable, Low Loss, Class I, 0.1 % , 100 GOhms, 1.06 mg, 0402, 1mm, 0.5mm, 0.5mm, 0.3mm, 0.3mm, 10000, 78 Weeks, 120 Source: Datasheet <https://componentsearchengine.com/Datasheets/1/C0402C271G5GACTU.pdf>; DESCRIPTION: SMD Comm C0G, Ceramic, 270 pF, 2%, 50 VDC, 125 VDC, 125C, -55C, C0G, SMD, MLCC, Ultra-Stable, Low Loss, Class I, 0.1 % , 100 GOhms, 1.06 mg, 0402, 1mm, 0.5mm, 0.5mm, 0.3mm, 0.3mm, 10000, 78 Weeks, 120; HEIGHT: 0.55mm; MANUFACTURER_NAME: KEMET; MANUFACTURER_PART_NUMBER: C0402C271G5GACTU; MOUSER_PART_NUMBER: 80-C0402C271G5G; MOUSER_PRICE-STOCK: https://www.mouser.com/Search/Refine.aspx?Keyword=80-C0402C271G5G
C2 C5 = MABOS_Library:CAPACITOR-10µF: SMD Comm X5R, Ceramic, 10 uF, 20%, 6.3 VDC, 15.75 VDC, 85C, -55C, X5R, SMD, MLCC, Temperature Stable, Class II, 10 % , 10 MOhms, 1.41 mg, 0402, 1mm, 0.5mm, 0.5mm, 0.3mm, 0.3mm, 10000, 78 Weeks, 70 Source: Datasheet <https://content.kemet.com/datasheets/KEM_C1006_X5R_SMD.pdf>; DESCRIPTION: SMD Comm X5R, Ceramic, 10 uF, 20%, 6.3 VDC, 15.75 VDC, 85C, -55C, X5R, SMD, MLCC, Temperature Stable, Class II, 10 % , 10 MOhms, 1.41 mg, 0402, 1mm, 0.5mm, 0.5mm, 0.3mm, 0.3mm, 10000, 78 Weeks, 70; HEIGHT: 0.55mm; MANUFACTURER_NAME: KEMET; MANUFACTURER_PART_NUMBER: C0402C106M9PACTU; MOUSER_PART_NUMBER: 80-C0402C106M9P; MOUSER_PRICE-STOCK: https://www.mouser.co.uk/ProductDetail/KEMET/C0402C106M9PACTU?qs=x4XeXhDQKnp%252Bz0lMlwMC3A%3D%3D
C3 = MABOS_Library:CAPACITOR-3.3µF: SMD Comm X5R, Ceramic, 3.3 uF, 20%, 4 VDC, 10 VDC, 85C, -55C, X5R, SMD, MLCC, Temperature Stable, Class II, 10 % , 30.3 MOhms, 1.21 mg, 0402, 1mm, 0.5mm, 0.5mm, 0.3mm, 0.3mm, 10000, 78 Weeks, 70 Source: Datasheet <https://content.kemet.com/datasheets/KEM_C1006_X5R_SMD.pdf>; DESCRIPTION: SMD Comm X5R, Ceramic, 3.3 uF, 20%, 4 VDC, 10 VDC, 85C, -55C, X5R, SMD, MLCC, Temperature Stable, Class II, 10 % , 30.3 MOhms, 1.21 mg, 0402, 1mm, 0.5mm, 0.5mm, 0.3mm, 0.3mm, 10000, 78 Weeks, 70; HEIGHT: 0.55mm; MANUFACTURER_NAME: KEMET; MANUFACTURER_PART_NUMBER: C0402C335M7PACTU; MOUSER_PART_NUMBER: 80-C0402C335M7P; MOUSER_PRICE-STOCK: https://www.mouser.co.uk/ProductDetail/KEMET/C0402C335M7PACTU?qs=K%2Fj%2Fqf%252B0fqJuKSSbbJXSEQ%3D%3D
C4 = MABOS_Library:CAPACITOR-5600PF: SMD Comm X7R, Ceramic, 5600 pF, 5%, 16 VDC, 40 VDC, 125C, -55C, X7R, SMD, MLCC, Temperature Stable, Class II, 3.5 % , 100 GOhms, 1.21 mg, 0402, 1mm, 0.5mm, 0.5mm, 0.3mm, 0.3mm, 10000, 78 Weeks, 80 Source: Datasheet <https://content.kemet.com/datasheets/KEM_C1002_X7R_SMD.pdf>; DESCRIPTION: SMD Comm X7R, Ceramic, 5600 pF, 5%, 16 VDC, 40 VDC, 125C, -55C, X7R, SMD, MLCC, Temperature Stable, Class II, 3.5 % , 100 GOhms, 1.21 mg, 0402, 1mm, 0.5mm, 0.5mm, 0.3mm, 0.3mm, 10000, 78 Weeks, 80; HEIGHT: 0.55mm; MANUFACTURER_NAME: KEMET; MANUFACTURER_PART_NUMBER: C0402C562J4RACTU; MOUSER_PART_NUMBER: 80-C0402C562J4R; MOUSER_PRICE-STOCK: https://www.mouser.co.uk/ProductDetail/KEMET/C0402C562J4RACTU?qs=YJD0VjdmSUns5e35Blws8w%3D%3D
IC1 = MABOS_Library:ADA4505-2: Op Amp (2); DESCRIPTION: ANALOG DEVICES - ADA4505-2ACBZ-R7 - OP-AMP, DUAL, 50KHZ, WLCSP-8; HEIGHT: 0.65mm; MANUFACTURER_NAME: Analog Devices; MANUFACTURER_PART_NUMBER: ADA4505-2ACBZ-R7; MOUSER_PART_NUMBER: 584-ADA4505-2ACBZ-R7; MOUSER_PRICE-STOCK: https://www.mouser.co.uk/ProductDetail/Analog-Devices/ADA4505-2ACBZ-R7?qs=BpaRKvA4VqEsLtXU3NSLDQ%3D%3D
R3 R9 = MABOS_Library:RESISTOR-4.7MOHM: Panasonic ERJ2GEJ Series Thick Film Surface Mount Fixed Resistor 0402 Case 4.7M +/-5% 0.1W -400 +150ppm/C Source: Datasheet <https://componentsearchengine.com/Datasheets/1/ERJ-2GEJ475X.pdf>; DESCRIPTION: Panasonic ERJ2GEJ Series Thick Film Surface Mount Fixed Resistor 0402 Case 4.7M +/-5% 0.1W -400 +150ppm/C; HEIGHT: 0.4mm; MANUFACTURER_NAME: Panasonic; MANUFACTURER_PART_NUMBER: ERJ-2GEJ475X; MOUSER_PART_NUMBER: 667-ERJ-2GEJ475X; MOUSER_PRICE-STOCK: https://www.mouser.com/Search/Refine.aspx?Keyword=667-ERJ-2GEJ475X
R4 = MABOS_Library:RESISTOR-2.7KOHM: Anti-Surge Thick Film Chip Resistor, 0402, 0.2W Source: Datasheet <http://industrial.panasonic.com/cdbs/www-data/pdf/RDO0000/AOA0000C331.pdf>; DESCRIPTION: Anti-Surge Thick Film Chip Resistor, 0402, 0.2W; HEIGHT: 0.4mm; MANUFACTURER_NAME: Panasonic; MANUFACTURER_PART_NUMBER: ERJ-PA2F2701X
R5 = MABOS_Library:RESISTOR-56KOHM: Precision Thick Film Chip Resistor, 0402, 0.063W Source: Datasheet <https://componentsearchengine.com/Datasheets/1/ERJ-2RKF5602X.pdf>; DESCRIPTION: Precision Thick Film Chip Resistor, 0402, 0.063W; HEIGHT: 0.4mm; MANUFACTURER_NAME: Panasonic; MANUFACTURER_PART_NUMBER: ERJ-2RKF5602X; MOUSER_PART_NUMBER: 667-ERJ-2RKF5602X; MOUSER_PRICE-STOCK: https://www.mouser.com/Search/Refine.aspx?Keyword=667-ERJ-2RKF5602X
R8 = MABOS_Library:RESISTOR-150KOHM: Anti-Sulfurated Thick Film Chip Resistor, 0402, 0.1W Source: Datasheet <https://componentsearchengine.com/Datasheets/1/ERJ-U02D1503X.pdf>; DESCRIPTION: Anti-Sulfurated Thick Film Chip Resistor, 0402, 0.1W; HEIGHT: 0.4mm; MANUFACTURER_NAME: Panasonic; MANUFACTURER_PART_NUMBER: ERJ-U02D1503X; MOUSER_PART_NUMBER: 667-ERJ-U02D1503X; MOUSER_PRICE-STOCK: https://www.mouser.com/Search/Refine.aspx?Keyword=667-ERJ-U02D1503X
R10 = MABOS_Library:RESISTOR-3.3KOHM: Anti-Surge Thick Film Chip Resistor, 0402, 0.2W Source: Datasheet <https://componentsearchengine.com/Datasheets/1/ERJ-PA2F3301X.pdf>; DESCRIPTION: Anti-Surge Thick Film Chip Resistor, 0402, 0.2W; HEIGHT: 0.4mm; MANUFACTURER_NAME: Panasonic; MANUFACTURER_PART_NUMBER: ERJ-PA2F3301X; MOUSER_PART_NUMBER: 667-ERJ-PA2F3301X; MOUSER_PRICE-STOCK: https://www.mouser.com/Search/Refine.aspx?Keyword=667-ERJ-PA2F3301X
U$1 = MABOS_Library:UVPD

## Board
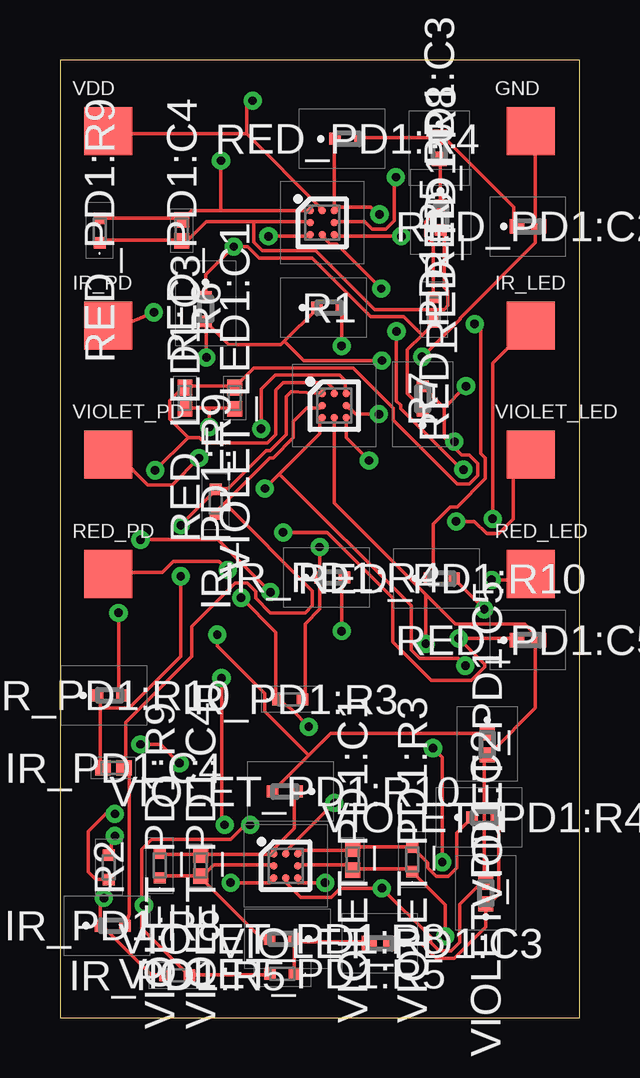
[diagram p7: board, top side]
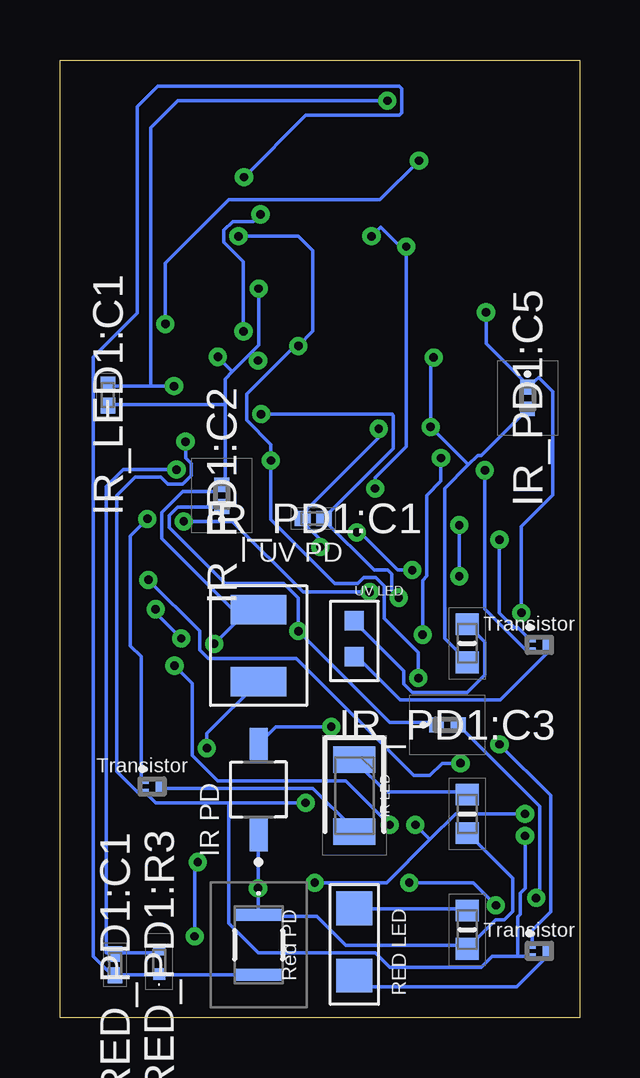
[diagram p8: board, bottom side, seen from below]

Size 21.66 x 39.94 mm. Coordinates in mm from the lower left corner, seen from the top.
Outline: 0,0 21.66,0 21.66,39.94 0,39.94 0,0
Copper layers (1*16): Top / Bottom
Stack-up Default Layer Stack: Top User Defined 0.035mm / Dielectric-1 User Defined 1.5mm / Bottom User Defined 0.035mm
Design rules "default": minimum track width 6mil, minimum drill 0.35mm, track to track 6mil, track to pad 6mil, pad to pad 6mil, via to via 6mil, smd to smd 6mil, copper to edge 40mil, drill to drill 6mil, minimum pad ring 10mil, minimum via ring 8mil, stop-mask expansion 4mil, vias tented up to drill 0mil, thermal gap 10mil

### Footprints (pad centres in the part's own frame; a part is rotated, then mirrored left to right if it is on the bottom)
PAD = smd 2 x 2: PAD 0,0
CAPC1005X55N = smd 0.65 x 0.62: 1 -0.44,0; 2 0.44,0
LEDC3216X180N = smd 1.1 x 1.75: 1 -1.5,0; 2 1.5,0
SOT883B = smd 0.4 x 0.25: 1 -0.35,0.225; 2 -0.35,-0.225 | smd 0.4 x 0.7: 3 0.35,0
RESC1608X55N = smd 0.9 x 0.95: 1 -0.8,0; 2 0.8,0
C0402 = smd 0.62 x 0.62: 1 -0.45,0; 2 0.45,0
XDCR_VEMD2023X01 = smd 1.35 x 0.75: A 1.9,0; C -1.9,0
BGA8C50P3X3_142X142X65 = smd 0.306 x 0.306: A1 -0.5,0.5; A2 0,0.5; A3 0.5,0.5; B1 -0.5,0; B3 0.5,0; C1 -0.5,-0.5; C2 0,-0.5; C3 0.5,-0.5
ERJ2RKD1004X = smd 0.475 x 0.5: 1 -0.512,0; 2 0.512,0
ERJPA2_(0402) = smd 0.475 x 0.5: 1 -0.512,0; 2 0.512,0
ERJS02_U02_(0402) = smd 0.475 x 0.5: 1 -0.512,0; 2 0.512,0
REDLED = smd 1.4 x 1.5: IN 2.8,0; OUT 0,0
SFH2713 = smd 0.5 x 1.9: 1 -1.25,0; 2 1.25,0
UVLED = smd 0.8 x 0.8: IN 0,0; OUT 0,1.5
UVPD = smd 2.3 x 1.23: IN 0,0; OUT 0,3

### Placement (x,y rotation side)
GND  19.62,36.97 0 top
IR_LED  19.62,28.86 0 top
IR_LED1:C1  CAPACITOR-12PF  [CAPC1005X55N]  19.67,25.97 90 bottom
IR_LED1:LED1  IRLED  [LEDC3216X180N]  9.4,9.27 270 bottom
IR_LED1:Q1  TRANSISTOR  [SOT883B]  17.82,9.65 0 bottom
IR_LED1:R1  RESISTOR-100OHM  [RESC1608X55N]  4.7,8.51 90 bottom
IR_PD  2.02,28.86 0 top
IR_PD1:C1  CAPACITOR-270PF  [CAPC1005X55N]  11.11,20.83 180 bottom
IR_PD1:C2  CAPACITOR-10µF  [C0402]  14.92,21.78 90 bottom
IR_PD1:C3  CAPACITOR-3.3µF  [C0402]  5.53,12.22 0 bottom
IR_PD1:C4  CAPACITOR-5600PF  [CAPC1005X55N]  2.22,10.42 180 top
IR_PD1:C5  CAPACITOR-10µF  [C0402]  2.18,25.85 270 bottom
IR_PD1:D1  IRPD  [XDCR_VEMD2023X01]  13.39,9.53 90 bottom
IR_PD1:IC1  ADA4505-2  [BGA8C50P3X3_142X142X65]  11.43,25.53 0 top
IR_PD1:R3  RESISTOR-4.7MOHM  [ERJ2RKD1004X]  9.59,13.29 0 top
IR_PD1:R4  RESISTOR-2.7KOHM  [ERJPA2_(0402)]  11.34,18.37 0 top
IR_PD1:R5  RESISTOR-56KOHM  [ERJ2RKD1004X]  4.89,1.77 0 top
IR_PD1:R8  RESISTOR-150KOHM  [ERJS02_U02_(0402)]  2.2,3.85 0 top
IR_PD1:R9  RESISTOR-4.7MOHM  [ERJ2RKD1004X]  6.49,21.52 90 top
IR_PD1:R10  RESISTOR-3.3KOHM  [ERJPA2_(0402)]  2.07,13.45 0 top
R1  11.21,29.61 0 top
R2  2.04,6.28 90 top
R6  6.07,29.55 270 top
R7  15.11,25.82 90 top
RED_LED  19.62,18.51 0 top
RED_LED1:C3  CAPACITOR-12PF  [CAPC1005X55N]  5.21,25.84 90 top
RED_LED1:Q1  TRANSISTOR  [SOT883B]  1.69,2.79 0 bottom
RED_LED1:R5  RESISTOR-100OHM  [RESC1608X55N]  4.7,3.68 90 bottom
RED_LED1:U$1  REDLED  [REDLED]  9.4,4.57 270 bottom
RED_PD  2.02,18.51 0 top
RED_PD1:C1  CAPACITOR-270PF  [CAPC1005X55N]  19.37,2.22 90 bottom
RED_PD1:C2  CAPACITOR-10µF  [C0402]  19.49,33 0 top
RED_PD1:C3  CAPACITOR-3.3µF  [C0402]  15.8,36.26 270 top
RED_PD1:C4  CAPACITOR-5600PF  [CAPC1005X55N]  5.07,32.83 90 top
RED_PD1:C5  CAPACITOR-10µF  [C0402]  19.49,15.75 0 top
RED_PD1:D1  REDPD  [SFH2713]  13.39,3.05 270 bottom
RED_PD1:IC1  ADA4505-2  [BGA8C50P3X3_142X142X65]  10.92,33.15 0 top
RED_PD1:R3  RESISTOR-4.7MOHM  [ERJ2RKD1004X]  17.54,2.35 90 bottom
RED_PD1:R4  RESISTOR-2.7KOHM  [ERJPA2_(0402)]  11.98,36.65 0 top
RED_PD1:R5  RESISTOR-56KOHM  [ERJ2RKD1004X]  15.58,29.53 270 top
RED_PD1:R8  RESISTOR-150KOHM  [ERJS02_U02_(0402)]  15.86,33.36 270 top
RED_PD1:R9  RESISTOR-4.7MOHM  [ERJ2RKD1004X]  1.65,32.83 90 top
RED_PD1:R10  RESISTOR-3.3KOHM  [ERJPA2_(0402)]  15.91,18.32 0 top
VDD  2.02,36.97 0 top
VIOLET_LED  19.62,23.49 0 top
VIOLET_LED1:C1  CAPACITOR-12PF  [CAPC1005X55N]  7.28,25.84 90 top
VIOLET_LED1:Q1  TRANSISTOR  [SOT883B]  1.69,15.56 0 bottom
VIOLET_LED1:R1  RESISTOR-100OHM  [RESC1608X55N]  4.7,15.62 90 bottom
VIOLET_LED1:U$1  UVLED  [UVLED]  9.4,15.07 0 bottom
VIOLET_PD  2.02,23.49 0 top
VIOLET_PD1:C1  CAPACITOR-270PF  [CAPC1005X55N]  12.19,6.61 90 top
VIOLET_PD1:C2  CAPACITOR-10µF  [C0402]  17.74,5.21 90 top
VIOLET_PD1:C3  CAPACITOR-3.3µF  [C0402]  13.33,3.11 180 top
VIOLET_PD1:C4  CAPACITOR-5600PF  [CAPC1005X55N]  5.86,6.35 90 top
VIOLET_PD1:C5  CAPACITOR-10µF  [C0402]  17.8,11.43 270 top
VIOLET_PD1:IC1  ADA4505-2  [BGA8C50P3X3_142X142X65]  9.4,6.35 0 top
VIOLET_PD1:R3  RESISTOR-4.7MOHM  [ERJ2RKD1004X]  14.67,6.61 90 top
VIOLET_PD1:R4  RESISTOR-2.7KOHM  [ERJPA2_(0402)]  17.68,8.36 0 top
VIOLET_PD1:R5  RESISTOR-56KOHM  [ERJ2RKD1004X]  9.27,1.85 180 top
VIOLET_PD1:R8  RESISTOR-150KOHM  [ERJS02_U02_(0402)]  9.24,3.3 180 top
VIOLET_PD1:R9  RESISTOR-4.7MOHM  [ERJ2RKD1004X]  4.15,6.35 90 top
VIOLET_PD1:R10  RESISTOR-3.3KOHM  [ERJPA2_(0402)]  9.37,9.44 180 top
VIOLET_PD1:U$1  UVPD  [UVPD]  13.39,14.02 0 bottom

### Tracks (layer width: path | path; a pad name or v marks a point on that pad's centre or on a via)
+IN_A_DIV  (via drill 0.35)
  Top 0.152: v14.22,32.59 11.43,32.59 RED_PD1:IC1.C3 | v11.73,28.02 11.73,29.54 R1.2 | v12.88,23.24 11.93,24.19 IR_PD1:IC1.C3 | v11.05,5.64 9.92,5.64 VIOLET_PD1:IC1.C3 | v6.73,14.17 6.73,8.18 v6.86,8.05 | R2.1 1.49,5.77 1.18,6.09 1.18,7.78 1.91,8.51 v2.29,8.51
  Bottom 0.152: v14.22,32.59 11.73,32.59 11.12,31.98 11.12,28.63 v11.73,28.02 11.89,28.02 13.89,26.01 13.89,24.92 12.88,23.91 v12.88,23.24 12.88,20.78 10.21,18.11 9.27,18.11 9.01,18.36 8.51,18.36 8.16,18.01 8.16,16.66 6.73,15.24 v6.73,14.17 | v11.05,5.64 8.05,5.64 6.25,7.44 | 6.25,7.44 5.18,8.51 v2.29,8.51 | 6.25,7.44 v6.86,8.05
+IN_B_DIV  (via drill 0.35)
  Top 0.152: v7.11,5.64 8.75,5.64 VIOLET_PD1:IC1.C1 | 3.4,4.7 3.4,3.73 5.33,1.8 IR_PD1:R5.2 5.49,1.8 8.69,1.8 VIOLET_PD1:R5.2 | 15.09,28.47 15.54,28.93 RED_PD1:R5.2 | 15.09,28.47 14.48,27.86 14.48,26.04 15.09,25.42 R7.1 | v8.69,32.59 10.36,32.59 RED_PD1:IC1.C1 | R6.1 6.07,30.98 v7.24,32.16 7.83,32.16 8.31,31.68 10.51,31.68 12.95,29.23 14.33,29.23 15.09,28.47 | v8.53,22.07 9.14,22.68 | 9.14,22.68 10.82,24.36 10.82,24.97 IR_PD1:IC1.C1 | 3.4,4.7 3.4,7.04 3.81,7.44 7.11,7.44 7.72,8.05 v7.92,8.05 | 9.14,22.68 14.63,17.19 14.63,15.34 14.99,14.99 16.59,14.99 v16.89,14.69 | v3.5,4.7 3.4,4.7
  Bottom 0.152: v8.69,32.59 8.31,32.97 7.49,32.16 v7.24,32.16 7.24,23.82 8.53,22.53 v8.53,22.07 | v7.92,8.05 9.75,9.88 15.09,9.88 16.15,10.95 16.15,13.95 v16.89,14.69 | v7.11,5.64 4.44,5.64 v3.5,4.7
GND  (via drill 0.35)
  Top 0.152: VIOLET_PD1:IC1.C2 9.45,5.77 9.45,5.61 10.03,5.03 11.3,5.03 11.68,5.41 v13.41,5.41 15.45,3.38 15.45,3.15 15.8,2.8 16.3,2.8 16.66,3.15 16.66,4.75 17.68,5.77 | 17.68,5.77 17.68,10.95 VIOLET_PD1:C5.2 17.83,11.1 17.98,11.1 19.81,12.93 19.81,15.67 RED_PD1:C5.2 19.96,15.82 19.36,16.43 16.46,16.43 15.24,17.65 | VIOLET_PD1:C2.2 17.68,5.77 | IR_PD1:IC1.C2 11.43,21.46 15.24,17.65 | 6.22,25.42 7.16,25.42 VIOLET_LED1:C1.1 | 6.22,25.42 5.33,25.42 RED_LED1:C3.1 | v6.22,24.64 6.22,25.42 | GND.PAD 19.66,36.86 19.81,36.7 19.81,33.05 RED_PD1:C2.2 19.81,32.89 19.81,32.33 16.67,29.18 16.67,29.14 v15.09,27.56 | 9.35,28.22 10.67,29.54 R1.1 | 9.35,28.22 9.2,28.07 7.04,28.07 R6.2 6.1,28.93 v6.1,27.53 | v15.24,15.6 15.24,17.65 | v13.39,30.4 11.52,32.27 11.26,32.27 11.04,32.49 11.04,32.53 RED_PD1:IC1.C2 | v13.41,27.41 12.11,27.41 10.16,27.41 9.35,28.22
  Bottom 0.152: IR_PD1:D1.C 13.41,7.59 v13.41,5.41 13.41,4.39 RED_PD1:D1.1 13.26,4.24 10.97,4.24 9.75,3.02 4.72,3.02 RED_LED1:R5.1 4.57,3.02 3.5,4.09 3.15,4.09 2.8,4.45 2.8,5.82 4.57,7.59 IR_LED1:R1.1 | 4.65,23.06 5.64,22.07 5.64,15.82 4.72,14.91 VIOLET_LED1:R1.1 | 4.65,23.06 4.27,23.44 4.12,23.44 2.29,25.27 IR_PD1:C5.2 | 4.65,23.06 v6.22,24.64 6.22,27.41 v6.1,27.53 | v13.39,30.4 13.39,28.04 13.72,27.71 | 14.48,26.95 14.78,26.64 14.78,25.58 | 14.48,26.95 13.72,27.71 | 14.78,25.58 14.78,22.38 IR_PD1:C2.2 15.2,21.95 16.55,21.95 17.42,21.08 17.42,19.98 14.48,17.04 | 14.78,25.58 19.66,25.58 IR_LED1:C1.1 | 13.72,27.71 v13.41,27.41 | 14.48,17.04 13.41,17.04 VIOLET_PD1:U$1.OUT | 14.48,26.95 v15.09,27.56 | v15.24,15.6 14.13,16.7 14.48,17.04
IR_LED1:N$1
  Bottom 0.152: IR_LED1:R1.2 4.72,9.42 8.08,9.42 9.3,10.64 IR_LED1:LED1.1
IR_LED1:N$4
  Bottom 0.152: IR_LED1:Q1.3 17.37,9.58 11.12,9.58 9.45,7.9 IR_LED1:LED1.2
IR_PD1:-IN_A_I  (via drill 0.35)
  Top 0.152: v10.36,12.14 9.65,12.86 IR_PD1:R3.1 8.99,13.37 8.99,16.08 v7.55,17.52 | IR_PD1:IC1.B3 12.05,25.41 12.09,25.41 12.32,25.17 v13.28,25.17
  Bottom 0.152: v10.36,12.14 12.68,12.14 13.26,11.56 IR_PD1:D1.A | v13.28,25.17 7.82,25.17 7.77,25.12 7.77,23.75 10.67,20.85 IR_PD1:C1.1 10.67,20.76 8.58,18.67 8,18.67 7.85,18.51 7.85,17.82 v7.55,17.52
IR_PD1:-IN_B_I
  Top 0.152: IR_PD1:R8.2 2.9,4.32 2.9,10.19 2.74,10.34 IR_PD1:C4.1 2.74,10.49 2.74,12.32 5.49,15.06 5.49,16.32 7.3,18.13 7.8,18.13 8.16,17.77 8.16,17.5 8.77,16.89 10.21,16.89 10.52,17.2 10.52,17.8 6.86,21.46 | 6.86,21.46 6.55,21.16 IR_PD1:R9.1 | IR_PD1:IC1.B1 10.82,25.42 10.28,25.42 9.73,24.87 9.73,24.19 8.89,23.35 8.74,23.35 6.86,21.46
IR_PD1:N$5  (via drill 0.35)
  Top 0.152: v11.73,16.13 11.73,18.26 IR_PD1:R4.2
  Bottom 0.152: IR_PD1:C3.1 6.1,12.32 7.92,12.32 v11.73,16.13 11.73,17.5 12.34,18.11 14.77,18.11 17.11,20.45 17.11,20.95 16.75,21.31 14.94,21.31 IR_PD1:C2.1
IR_PD1:N$7  (via drill 0.35)
  Top 0.152: IR_PD1:R5.1 4.27,1.8 3.81,1.8 1.83,3.79 IR_PD1:R8.1 1.69,4.86 v1.83,5
  Bottom 0.152: IR_PD1:C3.2 1.68,8.82 1.68,5.15 v1.83,5
IR_PD1:OUT_A_I  (via drill 0.35)
  Top 0.152: IR_PD1:R3.2 10.21,13.39 10.21,16.43 10.82,17.04 10.82,18.26 IR_PD1:R4.1 10.82,18.41 v10.82,19.63 | IR_PD1:IC1.A3 11.89,26.04 11.89,26.57 11.66,26.8 8.96,26.8 8.38,26.22 v8.38,24.56
  Bottom 0.152: v10.82,19.63 10.82,19.94 11.58,20.7 IR_PD1:C1.2 11.43,20.85 11.43,21.16 8.38,24.21 v8.38,24.56
IR_PD1:OUT_B_I  (via drill 0.35)
  Top 0.152: 1.68,12.93 1.68,10.49 IR_PD1:C4.2 | 1.68,12.93 1.68,13.39 IR_PD1:R10.1 | IR_PD1:IC1.A1 9.64,26.12 9.42,25.91 9.42,24.32 8.76,23.65 8.59,23.65 7.01,22.07 6.55,22.07 IR_PD1:R9.2 6.4,21.92 v5.03,20.55 | 1.68,12.93 2.9,12.93 5.03,15.06 v5.03,18.41
  Bottom 0.152: v5.03,20.55 v5.03,18.41
N$1  (via drill 0.35)
  Top 0.152: v17.68,17.04 16.46,18.26 RED_PD1:R10.2 | RED_PD1:C5.1 18.9,15.82 v16.61,15.82 17.7,14.74 17.7,14.63 17.14,14.08 15.47,14.08 13.87,15.68 13.87,17.5 11.12,20.24 v9.3,20.24 | RED_PD.PAD 2.13,18.57 4.27,18.57 4.72,19.02 6.64,19.02 v6.99,18.67
  Bottom 0.152: v17.68,17.04 17.68,16.89 v16.61,15.82 | v9.3,20.24 9.15,20.24 7.58,18.67 v6.99,18.67
N$2  (via drill 0.35)
  Top 0.152: v3.35,11.41 4.19,11.41 v4.98,10.62 | v17.98,18.26 19.36,18.26 19.51,18.41 RED_LED.PAD
  Bottom 0.152: v4.98,10.62 5.74,10.62 6.25,10.11 6.93,10.11 11.81,14.99 15.49,14.99 15.85,15.34 15.85,16.13 v17.98,18.26 | RED_LED1:Q1.1 1.98,3.02 1.98,3.66 1.22,4.42 1.22,9.27 v3.35,11.41
N$3  (via drill 0.35)
  Top 0.152: IR_LED.PAD 19.51,28.78 18.02,27.29 v18.02,20.8
  Bottom 0.152: IR_LED1:Q1.1 18.29,9.88 18.29,15.06 18.75,15.52 18.75,20.08 v18.02,20.8
N$4  (via drill 0.35)
  Top 0.152: v3.35,19.94 6.58,19.94 v8.76,17.75 | VIOLET_LED.PAD 18.89,22.76 18.89,20.81 18.28,20.2 17.77,20.2 17.27,20.7 v16.51,20.7
  Bottom 0.152: v3.35,19.94 3.35,16.89 2.74,16.28 2.59,16.28 2.13,15.82 VIOLET_LED1:Q1.1 | v8.76,17.75 11.53,17.75 14.48,20.7 v16.51,20.7
N$5  (via drill 0.35)
  Top 0.152: 10.36,10.95 11.28,11.86 17.68,11.86 VIOLET_PD1:C5.1 | 10.36,10.95 8.99,9.58 VIOLET_PD1:R10.2 | v5.79,23.34 4.67,22.22 3.66,22.22 2.44,23.44 2.13,23.44 VIOLET_PD.PAD | v6.55,15.98 6.55,15.52 8.53,13.54 8.53,12.78 10.36,10.95
  Bottom 0.152: v5.79,23.34 5.79,22.38 6.38,21.79 6.38,18.42 6.55,18.25 v6.55,15.98
N$6  (via drill 0.35)
  Top 0.152: v2.44,16.89 2.44,13.54 IR_PD1:R10.2 | v3.91,29.41 2.22,28.72 IR_PD.PAD
  Bottom 0.152: v2.44,16.89 2.44,20.5 1.14,21.79 1.14,26.11 1.73,26.69 2.13,26.34 | 2.13,26.34 3.91,28.12 v3.91,29.41 | 2.13,26.34 IR_PD1:C5.1
RED_LED1:N$7
  Bottom 0.152: RED_LED1:U$1.IN 8.92,1.29 2.64,1.29 1.37,2.57 1.37,2.72 RED_LED1:Q1.3
RED_LED1:N$13
  Bottom 0.152: RED_LED1:R5.2 4.72,4.55 9.3,4.55 RED_LED1:U$1.OUT
RED_PD1:-IN_A_R  (via drill 0.35)
  Top 0.152: RED_PD1:IC1.B3 11.43,33.2 12.71,33.2 13.01,32.89 13.56,32.89 13.92,33.25 13.92,34.98 v13.99,35.05
  Bottom 0.152: RED_PD1:D1.2 13.41,1.8 17.53,1.8 RED_PD1:R3.1 17.68,1.8 19.36,1.8 RED_PD1:C1.1 19.51,1.8 20.27,2.57 20.27,27.56 18.44,29.39 18.44,38 17.59,38.85 7.52,38.85 7.42,38.74 7.42,37.73 7.52,37.63 11.42,37.63 v13.99,35.05
RED_PD1:-IN_B_R
  Top 0.152: 8.08,33.2 6.1,33.2 5.18,32.28 RED_PD1:C4.1 5.03,32.44 1.68,32.44 RED_PD1:R9.1 | 8.08,33.2 10.36,33.2 RED_PD1:IC1.B1 | RED_PD1:R8.2 16,32.74 16,30.45 16.15,30.3 16.15,29.69 16,29.54 13.11,29.54 10.66,31.98 8.44,31.98 8.08,32.34 8.08,33.2
RED_PD1:N$1
  Top 0.152: RED_PD1:R4.2 12.5,36.7 15.7,36.7 RED_PD1:C3.1 15.85,36.86 18.9,33.81 18.9,33.05 RED_PD1:C2.1
RED_PD1:N$3
  Top 0.152: RED_PD1:R5.1 15.54,30.15 15.54,32.28 15.24,32.59 15.24,33.2 15.85,33.81 RED_PD1:R8.1 15.85,33.96 15.85,35.79 RED_PD1:C3.2
RED_PD1:OUT_A_R  (via drill 0.35)
  Top 0.152: 11.43,33.81 11.43,36.55 RED_PD1:R4.1 | 11.43,33.81 RED_PD1:IC1.A3 | 11.43,33.81 12.95,33.81 13.26,33.5 v13.31,33.5 | v14.02,28.63 14.02,25.72 14.2,25.55 14.2,25.41 16.74,22.86 v16.81,22.86
  Bottom 0.152: 19.36,2.72 19.74,2.72 19.74,22.15 19.02,22.86 v16.81,22.86 | 19.36,2.72 17.68,2.72 RED_PD1:R3.2 | 19.36,2.72 RED_PD1:C1.2 | v14.02,28.63 14.02,31.53 14.83,32.34 14.83,32.84 14.47,33.2 13.62,33.2 v13.31,33.5
RED_PD1:OUT_B_R  (via drill 0.35)
  Top 0.152: 6.71,33.66 5.49,33.66 5.18,33.35 RED_PD1:C4.2 5.03,33.35 1.68,33.35 RED_PD1:R9.2 | 6.71,33.66 10.36,33.66 RED_PD1:IC1.A1 | 6.71,33.66 v6.71,35.74 | RED_PD1:R10.1 15.54,18.41 15.54,20.6 16.25,21.31 16.55,21.31 17.72,22.48 17.72,23.35 17.53,23.54 17.53,28.68 v17.27,28.93
  Bottom 0.152: v6.71,35.74 8.34,34.11 14.63,34.11 17.27,31.46 v17.27,28.93
VDD  (via drill 0.35)
  Top 0.152: v11.43,8.97 9.45,6.98 VIOLET_PD1:IC1.A2 | v2.29,7.59 2.13,7.44 2.13,6.83 R2.2 | IR_PD1:IC1.A2 11.43,26.19 11.12,26.49 9.3,26.49 8.99,26.18 8.99,24.31 8.63,23.96 6.04,23.96 5.8,24.21 5.33,24.21 | 5.33,24.21 4.57,24.97 4.57,25.73 5.18,26.34 RED_LED1:C3.2 5.33,26.34 7.16,26.34 VIOLET_LED1:C1.2 7.32,26.34 8.08,27.1 12.21,27.1 13.89,25.42 13.89,24.92 16.56,22.25 17.06,22.25 17.41,22.61 17.41,23.11 17.06,23.47 16.74,23.47 16.18,24.03 | 5.33,24.21 v3.96,22.83 | 7.77,36.86 10.82,33.81 10.82,33.66 RED_PD1:IC1.A2 | 7.77,36.86 2.13,36.86 VDD.PAD | 16,25.42 15.24,26.19 R7.2 | 16,25.42 16,24.21 16.18,24.03 | 16,25.42 v16.92,26.34 | v8.03,38.24 7.77,37.98 7.77,36.86 | 16.18,24.03 v16.43,24.03
  Bottom 0.152: 14.63,8.97 v11.43,8.97 | 14.63,8.97 17.68,8.97 18.14,9.42 IR_LED1:Q1.2 18.29,9.42 18.44,9.42 19.3,10.29 19.3,21.78 18.53,22.55 17.47,22.55 17.17,22.25 16.56,22.25 16.2,22.61 16.2,23.11 16.43,23.34 v16.43,24.03 | 2.59,2.57 3.66,2.57 4.12,2.11 7.92,2.11 8.53,2.72 13.41,2.72 14.63,3.94 14.63,8.97 | 2.59,2.57 2.13,2.57 RED_LED1:Q1.2 | v3.96,22.83 3.96,17.04 2.29,15.37 2.13,15.37 VIOLET_LED1:Q1.2 | v16.92,26.34 17.88,26.34 | 17.88,26.34 19.66,26.34 IR_LED1:C1.2 | 17.88,26.34 17.88,37.11 16.75,38.24 v8.03,38.24 | v2.29,7.59 2.29,5.4 2.49,5.2 2.49,4.32 2.59,4.22 2.59,2.57
VIOLET_LED1:N$1
  Bottom 0.152: VIOLET_LED1:U$1.OUT 9.3,16.43 7.34,14.48 7.34,13.92 6.98,13.57 4.7,13.57 3.96,14.3 3.96,15.67 4.57,16.28 VIOLET_LED1:R1.2
VIOLET_LED1:N$2
  Bottom 0.152: VIOLET_LED1:Q1.3 1.37,15.52 1.37,15.21 3.33,13.26 7.5,13.26 9.3,15.06 VIOLET_LED1:U$1.IN
VIOLET_PD1:-IN_A_V  (via drill 0.35)
  Top 0.152: 12.19,6.22 12.04,6.38 9.91,6.38 VIOLET_PD1:IC1.B3 | 12.19,6.22 14.63,6.22 VIOLET_PD1:R3.1 16.05,4.72 v16.05,3.4 | 12.19,6.22 VIOLET_PD1:C1.1 | v15.54,11.25 15.93,10.87 v15.93,6.5
  Bottom 0.152: v15.93,6.5 16.05,6.5 v16.05,3.4 | v15.54,11.25 15.54,11.86 13.41,14 VIOLET_PD1:U$1.IN
VIOLET_PD1:-IN_B_V
  Top 0.152: VIOLET_PD1:IC1.B1 8.84,6.38 6.4,6.38 5.94,5.92 VIOLET_PD1:C4.1 | VIOLET_PD1:R8.2 8.69,3.33 8.38,3.33 5.94,5.77 VIOLET_PD1:C4.1 | VIOLET_PD1:R9.1 4.27,5.92 5.79,5.92 VIOLET_PD1:C4.1
VIOLET_PD1:N$5
  Top 0.152: VIOLET_PD1:R4.2 18.29,8.36 18.29,5.16 17.83,4.7 VIOLET_PD1:C2.1 17.74,3.8 16.43,2.49 15.68,2.49 15.05,3.11 VIOLET_PD1:C3.1
VIOLET_PD1:N$7
  Top 0.152: VIOLET_PD1:R5.1 9.75,1.96 9.75,3.17 VIOLET_PD1:R8.1 9.91,3.17 12.8,3.17 VIOLET_PD1:C3.2
VIOLET_PD1:OUT_A_V
  Top 0.152: VIOLET_PD1:IC1.A3 9.91,6.98 12.19,6.98 VIOLET_PD1:C1.2 12.19,7.14 14.63,7.14 VIOLET_PD1:R3.2 15.32,6.47 15.32,6.25 15.67,5.9 16.18,5.9 16.53,6.25 16.53,7.72 VIOLET_PD1:R4.1
VIOLET_PD1:OUT_B_V
  Top 0.152: VIOLET_PD1:R9.2 4.27,6.83 5.79,6.83 VIOLET_PD1:C4.2 5.94,6.83 8.84,6.83 VIOLET_PD1:IC1.A1 8.84,6.98 9.75,7.9 9.75,9.42 VIOLET_PD1:R10.1